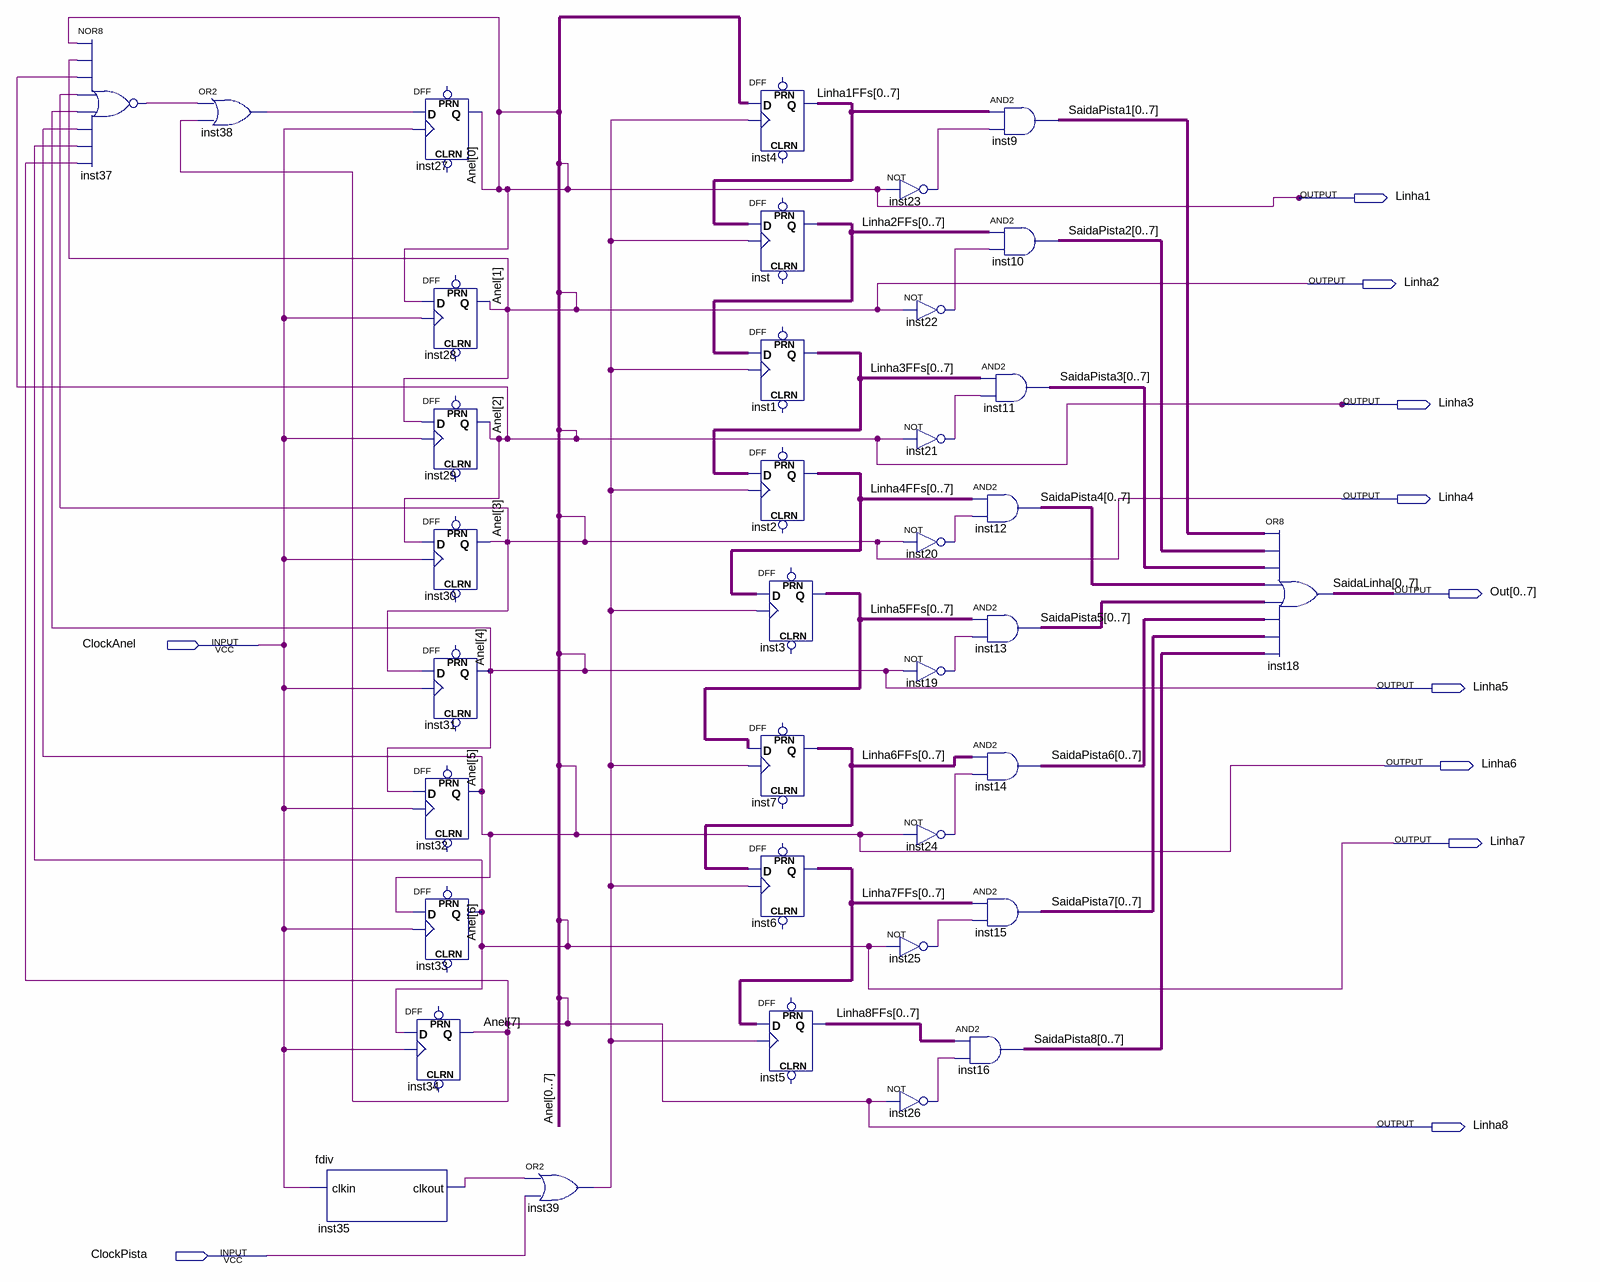
[diagram p0: schematic sheet]
// Quartus schematic SomeRandomStuff.bdf as structural Verilog: 37 symbols, 11 pins
module SomeRandomStuff (
  input  ClockAnel,
  input  ClockPista,
  output Linha1,
  output Linha2,
  output Linha3,
  output Linha4,
  output [0:7] Out,
  output Linha5,
  output Linha6,
  output Linha7,
  output Linha8
);

  wire inst19_out, inst20_out, inst21_out, inst22_out, inst23_out, inst24_out, inst25_out, inst26_out,
       inst35_clkout, inst37_out, inst38_out, inst39_out;
  wire [7:0] Linha1FFs, Linha2FFs, Linha3FFs, Linha4FFs, Linha5FFs, Linha6FFs, Linha7FFs, Linha8FFs,
       SaidaPista1, SaidaPista2, SaidaPista3, SaidaPista4, SaidaPista5, SaidaPista6, SaidaPista7, SaidaPista8;

  nor inst37 (inst37_out, Linha1, Linha2, Linha3, Linha4, Linha5, Linha6, Linha7, Linha8);
  or inst38 (inst38_out, inst37_out, Linha8);
  fdiv inst35 (.clkin(ClockAnel), .clkout(inst35_clkout));
  DFF inst27 (.CLK(ClockAnel), .D(inst38_out), .Q(Linha1));  // open: CLRN, PRN
  DFF inst28 (.CLK(ClockAnel), .D(Linha1), .Q(Linha2));  // open: CLRN, PRN
  DFF inst29 (.CLK(ClockAnel), .D(Linha2), .Q(Linha3));  // open: CLRN, PRN
  DFF inst30 (.CLK(ClockAnel), .D(Linha3), .Q(Linha4));  // open: CLRN, PRN
  DFF inst31 (.CLK(ClockAnel), .D(Linha4), .Q(Linha5));  // open: CLRN, PRN
  DFF inst32 (.CLK(ClockAnel), .D(Linha5), .Q(Linha6));  // open: CLRN, PRN
  DFF inst33 (.CLK(ClockAnel), .D(Linha6), .Q(Linha7));  // open: CLRN, PRN
  DFF inst34 (.CLK(ClockAnel), .D(Linha7), .Q(Linha8));  // open: CLRN, PRN
  or inst39 (inst39_out, inst35_clkout, ClockPista);
  DFF inst4[7:0] (
    .CLK(inst39_out), .D({Linha1, Linha2, Linha3, Linha4, Linha5, Linha6, Linha7, Linha8}),
    .Q({Linha1FFs[0], Linha1FFs[1], Linha1FFs[2], Linha1FFs[3], Linha1FFs[4], Linha1FFs[5], Linha1FFs[6], Linha1FFs[7]}));  // open: CLRN, PRN
  DFF inst[7:0] (
    .CLK(inst39_out),
    .D({Linha1FFs[0], Linha1FFs[1], Linha1FFs[2], Linha1FFs[3], Linha1FFs[4], Linha1FFs[5], Linha1FFs[6], Linha1FFs[7]}),
    .Q({Linha2FFs[0], Linha2FFs[1], Linha2FFs[2], Linha2FFs[3], Linha2FFs[4], Linha2FFs[5], Linha2FFs[6], Linha2FFs[7]}));  // open: CLRN, PRN
  DFF inst1[7:0] (
    .CLK(inst39_out),
    .D({Linha2FFs[0], Linha2FFs[1], Linha2FFs[2], Linha2FFs[3], Linha2FFs[4], Linha2FFs[5], Linha2FFs[6], Linha2FFs[7]}),
    .Q({Linha3FFs[0], Linha3FFs[1], Linha3FFs[2], Linha3FFs[3], Linha3FFs[4], Linha3FFs[5], Linha3FFs[6], Linha3FFs[7]}));  // open: CLRN, PRN
  DFF inst2[7:0] (
    .CLK(inst39_out),
    .D({Linha3FFs[0], Linha3FFs[1], Linha3FFs[2], Linha3FFs[3], Linha3FFs[4], Linha3FFs[5], Linha3FFs[6], Linha3FFs[7]}),
    .Q({Linha4FFs[0], Linha4FFs[1], Linha4FFs[2], Linha4FFs[3], Linha4FFs[4], Linha4FFs[5], Linha4FFs[6], Linha4FFs[7]}));  // open: CLRN, PRN
  DFF inst3[7:0] (
    .CLK(inst39_out),
    .D({Linha4FFs[0], Linha4FFs[1], Linha4FFs[2], Linha4FFs[3], Linha4FFs[4], Linha4FFs[5], Linha4FFs[6], Linha4FFs[7]}),
    .Q({Linha5FFs[0], Linha5FFs[1], Linha5FFs[2], Linha5FFs[3], Linha5FFs[4], Linha5FFs[5], Linha5FFs[6], Linha5FFs[7]}));  // open: CLRN, PRN
  DFF inst7[7:0] (
    .CLK(inst39_out),
    .D({Linha5FFs[0], Linha5FFs[1], Linha5FFs[2], Linha5FFs[3], Linha5FFs[4], Linha5FFs[5], Linha5FFs[6], Linha5FFs[7]}),
    .Q({Linha6FFs[0], Linha6FFs[1], Linha6FFs[2], Linha6FFs[3], Linha6FFs[4], Linha6FFs[5], Linha6FFs[6], Linha6FFs[7]}));  // open: CLRN, PRN
  DFF inst6[7:0] (
    .CLK(inst39_out),
    .D({Linha6FFs[0], Linha6FFs[1], Linha6FFs[2], Linha6FFs[3], Linha6FFs[4], Linha6FFs[5], Linha6FFs[6], Linha6FFs[7]}),
    .Q({Linha7FFs[0], Linha7FFs[1], Linha7FFs[2], Linha7FFs[3], Linha7FFs[4], Linha7FFs[5], Linha7FFs[6], Linha7FFs[7]}));  // open: CLRN, PRN
  DFF inst5[7:0] (
    .CLK(inst39_out),
    .D({Linha7FFs[0], Linha7FFs[1], Linha7FFs[2], Linha7FFs[3], Linha7FFs[4], Linha7FFs[5], Linha7FFs[6], Linha7FFs[7]}),
    .Q({Linha8FFs[0], Linha8FFs[1], Linha8FFs[2], Linha8FFs[3], Linha8FFs[4], Linha8FFs[5], Linha8FFs[6], Linha8FFs[7]}));  // open: CLRN, PRN
  not inst23 (inst23_out, Linha1);
  not inst22 (inst22_out, Linha2);
  not inst21 (inst21_out, Linha3);
  not inst20 (inst20_out, Linha4);
  not inst19 (inst19_out, Linha5);
  not inst24 (inst24_out, Linha6);
  not inst25 (inst25_out, Linha7);
  not inst26 (inst26_out, Linha8);
  assign {SaidaPista3[0], SaidaPista3[1], SaidaPista3[2], SaidaPista3[3], SaidaPista3[4], SaidaPista3[5], SaidaPista3[6], SaidaPista3[7]} = {Linha3FFs[0], Linha3FFs[1], Linha3FFs[2], Linha3FFs[3], Linha3FFs[4], Linha3FFs[5], Linha3FFs[6], Linha3FFs[7]} & {8{inst21_out}};  // AND2 inst11, 8 bits wide
  assign {SaidaPista4[0], SaidaPista4[1], SaidaPista4[2], SaidaPista4[3], SaidaPista4[4], SaidaPista4[5], SaidaPista4[6], SaidaPista4[7]} = {Linha4FFs[0], Linha4FFs[1], Linha4FFs[2], Linha4FFs[3], Linha4FFs[4], Linha4FFs[5], Linha4FFs[6], Linha4FFs[7]} & {8{inst20_out}};  // AND2 inst12, 8 bits wide
  assign {SaidaPista5[0], SaidaPista5[1], SaidaPista5[2], SaidaPista5[3], SaidaPista5[4], SaidaPista5[5], SaidaPista5[6], SaidaPista5[7]} = {Linha5FFs[0], Linha5FFs[1], Linha5FFs[2], Linha5FFs[3], Linha5FFs[4], Linha5FFs[5], Linha5FFs[6], Linha5FFs[7]} & {8{inst19_out}};  // AND2 inst13, 8 bits wide
  assign {SaidaPista6[0], SaidaPista6[1], SaidaPista6[2], SaidaPista6[3], SaidaPista6[4], SaidaPista6[5], SaidaPista6[6], SaidaPista6[7]} = {Linha6FFs[0], Linha6FFs[1], Linha6FFs[2], Linha6FFs[3], Linha6FFs[4], Linha6FFs[5], Linha6FFs[6], Linha6FFs[7]} & {8{inst24_out}};  // AND2 inst14, 8 bits wide
  assign {SaidaPista7[0], SaidaPista7[1], SaidaPista7[2], SaidaPista7[3], SaidaPista7[4], SaidaPista7[5], SaidaPista7[6], SaidaPista7[7]} = {Linha7FFs[0], Linha7FFs[1], Linha7FFs[2], Linha7FFs[3], Linha7FFs[4], Linha7FFs[5], Linha7FFs[6], Linha7FFs[7]} & {8{inst25_out}};  // AND2 inst15, 8 bits wide
  assign {SaidaPista8[0], SaidaPista8[1], SaidaPista8[2], SaidaPista8[3], SaidaPista8[4], SaidaPista8[5], SaidaPista8[6], SaidaPista8[7]} = {Linha8FFs[0], Linha8FFs[1], Linha8FFs[2], Linha8FFs[3], Linha8FFs[4], Linha8FFs[5], Linha8FFs[6], Linha8FFs[7]} & {8{inst26_out}};  // AND2 inst16, 8 bits wide
  assign {SaidaPista1[0], SaidaPista1[1], SaidaPista1[2], SaidaPista1[3], SaidaPista1[4], SaidaPista1[5], SaidaPista1[6], SaidaPista1[7]} = {Linha1FFs[0], Linha1FFs[1], Linha1FFs[2], Linha1FFs[3], Linha1FFs[4], Linha1FFs[5], Linha1FFs[6], Linha1FFs[7]} & {8{inst23_out}};  // AND2 inst9, 8 bits wide
  assign {SaidaPista2[0], SaidaPista2[1], SaidaPista2[2], SaidaPista2[3], SaidaPista2[4], SaidaPista2[5], SaidaPista2[6], SaidaPista2[7]} = {Linha2FFs[0], Linha2FFs[1], Linha2FFs[2], Linha2FFs[3], Linha2FFs[4], Linha2FFs[5], Linha2FFs[6], Linha2FFs[7]} & {8{inst22_out}};  // AND2 inst10, 8 bits wide
  assign Out = {SaidaPista1[0], SaidaPista1[1], SaidaPista1[2], SaidaPista1[3], SaidaPista1[4], SaidaPista1[5], SaidaPista1[6], SaidaPista1[7]} | {SaidaPista2[0], SaidaPista2[1], SaidaPista2[2], SaidaPista2[3], SaidaPista2[4], SaidaPista2[5], SaidaPista2[6], SaidaPista2[7]} | {SaidaPista3[0], SaidaPista3[1], SaidaPista3[2], SaidaPista3[3], SaidaPista3[4], SaidaPista3[5], SaidaPista3[6], SaidaPista3[7]} | {SaidaPista4[0], SaidaPista4[1], SaidaPista4[2], SaidaPista4[3], SaidaPista4[4], SaidaPista4[5], SaidaPista4[6], SaidaPista4[7]} | {SaidaPista5[0], SaidaPista5[1], SaidaPista5[2], SaidaPista5[3], SaidaPista5[4], SaidaPista5[5], SaidaPista5[6], SaidaPista5[7]} | {SaidaPista6[0], SaidaPista6[1], SaidaPista6[2], SaidaPista6[3], SaidaPista6[4], SaidaPista6[5], SaidaPista6[6], SaidaPista6[7]} | {SaidaPista7[0], SaidaPista7[1], SaidaPista7[2], SaidaPista7[3], SaidaPista7[4], SaidaPista7[5], SaidaPista7[6], SaidaPista7[7]} | {SaidaPista8[0], SaidaPista8[1], SaidaPista8[2], SaidaPista8[3], SaidaPista8[4], SaidaPista8[5], SaidaPista8[6], SaidaPista8[7]};  // OR8 inst18, 8 bits wide

  // Other names for the same wires on the sheet: Anel[7:0] = {Linha8, Linha7, Linha6, Linha5, Linha4, Linha3, Linha2, Linha1};
  //   SaidaLinha[7:0] = {Out[7], Out[6], Out[5], Out[4], Out[3], Out[2], Out[1], Out[0]}
endmodule
